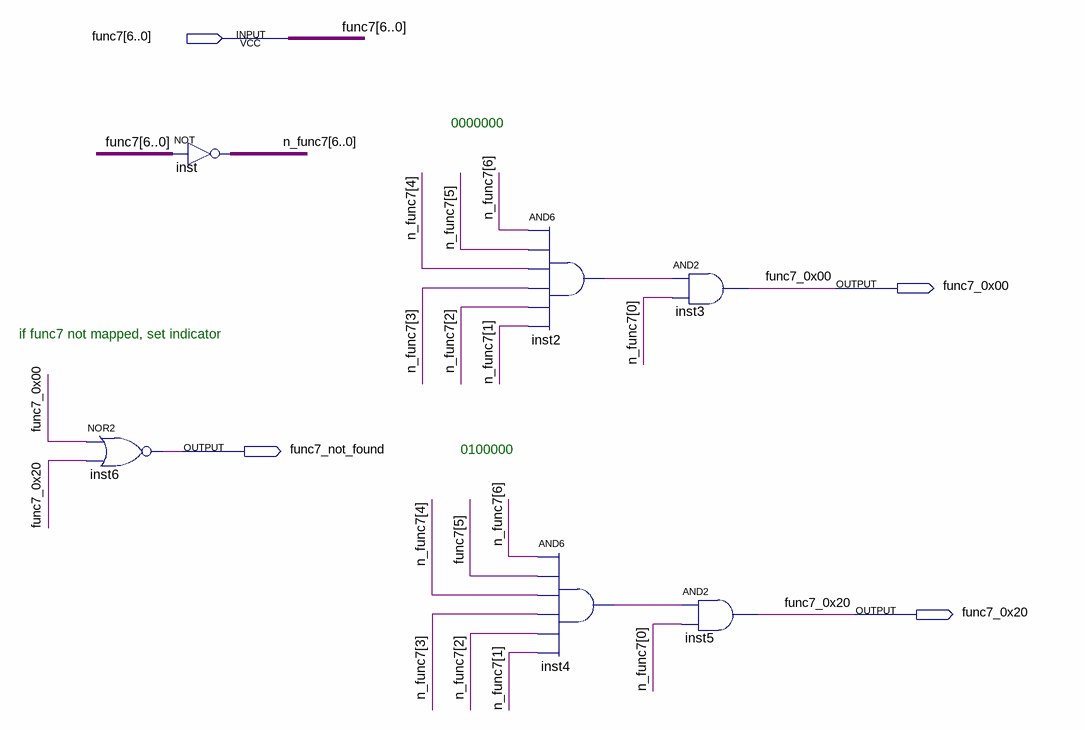
[diagram p0: schematic sheet]
// Quartus schematic func7_decoder.bdf as structural Verilog: 6 symbols, 4 pins
module func7_decoder (
  input  [6:0] func7,
  output func7_0x00,
  output func7_not_found,
  output func7_0x20
);

  wire inst2_out, inst4_out;
  wire [6:0] n_func7;

  nor inst6 (func7_not_found, func7_0x00, func7_0x20);
  assign n_func7 = ~func7;  // NOT inst, 7 bits wide
  and inst2 (inst2_out, n_func7[6], n_func7[5], n_func7[4], n_func7[3], n_func7[2], n_func7[1]);
  and inst4 (inst4_out, n_func7[6], func7[5], n_func7[4], n_func7[3], n_func7[2], n_func7[1]);
  and inst3 (func7_0x00, inst2_out, n_func7[0]);
  and inst5 (func7_0x20, inst4_out, n_func7[0]);

  // Notes on the sheet:
  //   0000000
  //   if func7 not mapped, set indicator
  //   0100000
endmodule
